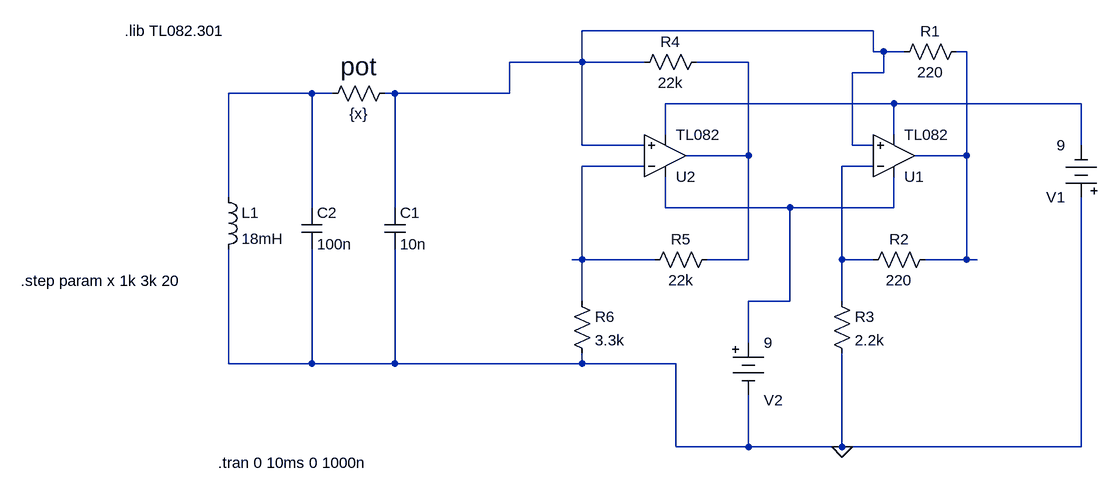
[diagram p0: schematic tl082 kolo.asc]
tl082 kolo.asc, the LTspice schematic file:
Version 4
SHEET 1 1496 680
WIRE 656 -656 208 -656
WIRE 656 -624 656 -656
WIRE 672 -624 656 -624
WIRE 704 -624 672 -624
WIRE 800 -624 784 -624
WIRE 208 -608 208 -656
WIRE 208 -608 96 -608
WIRE 304 -608 208 -608
WIRE 464 -608 384 -608
WIRE 672 -592 672 -624
WIRE 672 -592 624 -592
WIRE -208 -560 -336 -560
WIRE -176 -560 -208 -560
WIRE -80 -560 -96 -560
WIRE 96 -560 96 -608
WIRE 96 -560 -80 -560
WIRE 688 -544 336 -544
WIRE 976 -544 688 -544
WIRE 336 -496 336 -544
WIRE 688 -496 688 -544
WIRE 208 -480 208 -608
WIRE 304 -480 208 -480
WIRE 624 -480 624 -592
WIRE 656 -480 624 -480
WIRE 976 -480 976 -544
WIRE 464 -464 464 -608
WIRE 464 -464 368 -464
WIRE 800 -464 800 -624
WIRE 800 -464 720 -464
WIRE 304 -448 208 -448
WIRE 656 -448 608 -448
WIRE -336 -400 -336 -560
WIRE -208 -384 -208 -560
WIRE -80 -384 -80 -560
WIRE 336 -384 336 -432
WIRE 528 -384 336 -384
WIRE 688 -384 688 -432
WIRE 688 -384 528 -384
WIRE 208 -304 208 -448
WIRE 208 -304 192 -304
WIRE 320 -304 208 -304
WIRE 464 -304 464 -464
WIRE 464 -304 400 -304
WIRE 608 -304 608 -448
WIRE 656 -304 608 -304
WIRE 800 -304 800 -464
WIRE 800 -304 736 -304
WIRE 816 -304 800 -304
WIRE 208 -240 208 -304
WIRE 528 -240 528 -384
WIRE 528 -240 464 -240
WIRE 608 -240 608 -304
WIRE 464 -176 464 -240
WIRE -336 -144 -336 -320
WIRE -208 -144 -208 -320
WIRE -208 -144 -336 -144
WIRE -80 -144 -80 -320
WIRE -80 -144 -208 -144
WIRE 208 -144 208 -160
WIRE 208 -144 -80 -144
WIRE 352 -144 208 -144
WIRE 352 -16 352 -144
WIRE 464 -16 464 -96
WIRE 464 -16 352 -16
WIRE 608 -16 608 -160
WIRE 608 -16 464 -16
WIRE 976 -16 976 -400
WIRE 976 -16 608 -16
FLAG 608 -16 0
SYMBOL cap -96 -384 R0
SYMATTR InstName C1
SYMATTR Value 10n
SYMBOL cap -224 -384 R0
SYMATTR InstName C2
SYMATTR Value 100n
SYMBOL ind -352 -416 R0
SYMATTR InstName L1
SYMATTR Value 18mH
SYMBOL Misc\\battery 976 -384 R180
WINDOW 123 0 0 Left 0
WINDOW 39 0 0 Left 0
SYMATTR InstName V1
SYMATTR Value 9
SYMBOL res -80 -576 R90
WINDOW 0 0 56 VBottom 4
WINDOW 3 32 56 VTop 2
SYMATTR InstName pot
SYMATTR Value {x}
SYMATTR SpiceLine tol=5
SYMBOL res 800 -640 R90
WINDOW 0 0 56 VBottom 2
WINDOW 3 32 56 VTop 2
SYMATTR InstName R1
SYMATTR Value 220
SYMBOL res 752 -320 R90
WINDOW 0 0 56 VBottom 2
WINDOW 3 32 56 VTop 2
SYMATTR InstName R2
SYMATTR Value 220
SYMBOL res 592 -256 R0
SYMATTR InstName R3
SYMATTR Value 2.2k
SYMBOL res 400 -624 R90
WINDOW 0 0 56 VBottom 2
WINDOW 3 32 56 VTop 2
SYMATTR InstName R4
SYMATTR Value 22k
SYMBOL res 416 -320 R90
WINDOW 0 0 56 VBottom 2
WINDOW 3 32 56 VTop 2
SYMATTR InstName R5
SYMATTR Value 22k
SYMBOL res 192 -256 R0
SYMATTR InstName R6
SYMATTR Value 3.3k
SYMBOL Misc\\battery 464 -192 R0
WINDOW 0 24 104 Left 2
WINDOW 3 24 16 Left 2
WINDOW 123 0 0 Left 0
WINDOW 39 0 0 Left 0
SYMATTR InstName V2
SYMATTR Value 9
SYMBOL OpAmps\\opamp2 336 -400 M180
SYMATTR InstName U2
SYMATTR Value TL082
SYMBOL OpAmps\\opamp2 688 -400 M180
SYMATTR InstName U1
SYMATTR Value TL082
TEXT -352 8 Left 2 !.tran 0 10ms 0 1000n
TEXT -496 -656 Left 2 !.lib TL082.301
TEXT -656 -272 Left 2 !.step param x 1k 3k 20

The netlist it stands for:
* tl082 kolo.asc
C1 N001 0 10n
C2 N004 0 100n
L1 N004 0 18mH
V1 0 N005 9
R§pot N001 N004 {x} tol=5
R1 N002 N001 220
R2 N002 N007 220
R3 N007 0 2.2k
R4 N003 N001 22k
R5 N003 N006 22k
R6 N006 0 3.3k
V2 N008 0 9
XU2 N001 N006 N008 N005 N003 TL082  ; pins In+ In- V+ V- OUT
XU1 N001 N007 N008 N005 N002 TL082  ; pins In+ In- V+ V- OUT
.tran 0 10ms 0 1000n
.lib TL082.301
.step param x 1k 3k 20
.backanno
.end